# EAGLE schematic PhatStats Slim Enclosure ESP Lolin32 LITE XTP2046 PCB v1.0 (EAGLE 7.6.0)
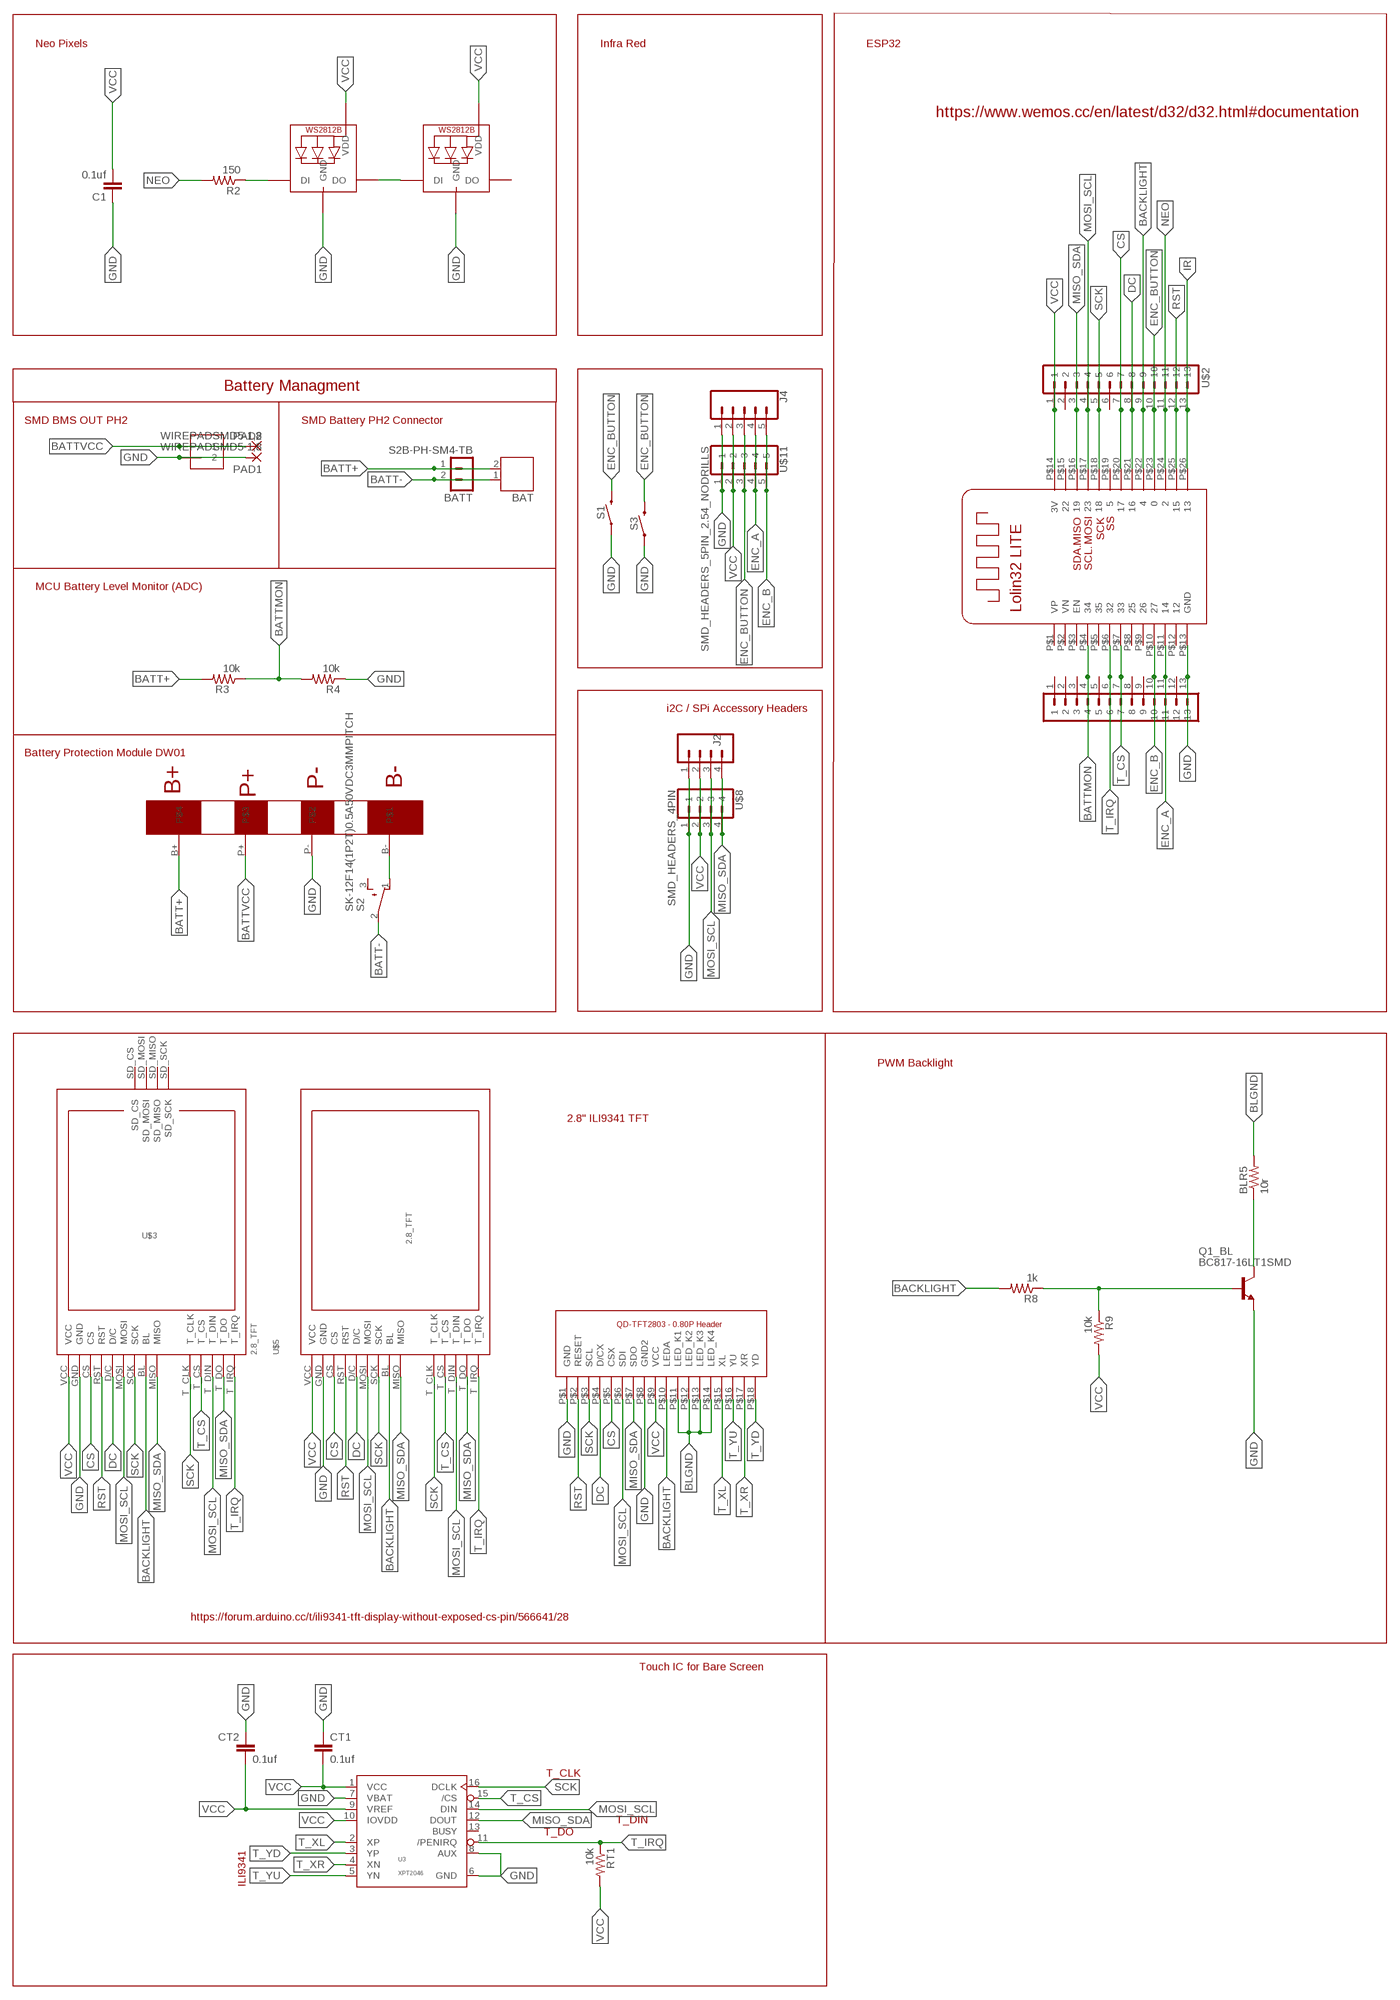
[diagram p0: schematic, sheet 1]

## Parts
0  ILI9341-2.8  [ILI9341-2.8]
BAT  JST-PH2  [JST-PH2]
BATT  S2B-PH-SM4-TB  [S2B-PH-SM4-TB]
BLR5  10r  R-US_M1206  [M1206]
C1  0.1uf  C-EUC1206  [C1206]
CT1  0.1uf  C-EUC1206  [C1206]
CT2  0.1uf  C-EUC1206  [C1206]
DW01-BMS  DW01BATTERYPROT  [DW01BATTERYPROT]
J1  1X2-3.5MM  [1X2-3.5MM]
J2  CONN_04PTH  [1X04]
J4  CONN_05  [1X05]
NEO1  WS2812B5050  [WS2812B]
NEO2  WS2812B5050  [WS2812B]
PAD1  WIREPADSMD5-1,8  [5-1,8]
PAD2  WIREPADSMD5-1,8  [5-1,8]
Q1_BL  BC817-16LT1SMD  [SOT23-BEC]
R2  150  R-US_M1206  [M1206]
R3  10k  R-US_M1206  [M1206]
R4  10k  R-US_M1206  [M1206]
R8  1k  R-US_M1206  [M1206]
R9  10k  R-US_M1206  [M1206]
RT1  10k  R-US_M1206  [M1206]
S1  MOMENTARY-SWITCH-SPST-PTH-6.0MM  [TACTILE_SWITCH_PTH_6.0MM]
S2  SK-12F14(1P2T)0.5A50VDC3MMPITCH  [SK-12F14(1P2T)0.5A50VDC3MMPITCH]
S3  MOMENTARY-SWITCH-SPST-SMD-6.2MM-TALL  [TACTILE_SWITCH_SMD_6.2MM_TALL]
U3  XPT2046  [TSSOP-16]
U$1  SMD_HEADERS_13PIN_2.54_NODRILLS  [SMD_HEADERS_13PIN]
U$2  SMD_HEADERS_13PIN_2.54_NODRILLS  [SMD_HEADERS_13PIN]
U$3  2.8_TFT  [2.8_TFT]
U$5  2.8_TFT  [2.8_TFT]
U$7  TML_LOLIND32_LITE  [TML_LOLIND32_LITE]
U$8  SMD_HEADERS_4PIN  [SMD_HEADERS_4PIN]
U$11  SMD_HEADERS_5PIN_2.54_NODRILLS  [SMD_HEADERS_5PIN]

## Nets
BACKLIGHT: 0.P$10(LEDA) R8.2 U$2.9 U$3.BL U$5.BL U$7.P$22
BATT+: BAT.2 BATT.1 DW01-BMS.B+ R3.2
BATT-: BAT.1 BATT.2 S2.2(P)
BATTMON: R3.1 R4.2 U$1.4 U$7.P$4
BATTVCC: DW01-BMS.P+ J1.1 PAD2.1(P)
BL: BLR5.1 Q1_BL.C
BLGND: 0.P$11(LED_K1) 0.P$12(LED_K2) 0.P$13(LED_K3) 0.P$14(LED_K4) BLR5.2
CS: 0.P$5(CSX) U$2.7 U$3.CS U$5.CS U$7.P$20
DC: 0.P$4(D/CX) U$2.8 U$3.D/C U$5.D/C U$7.P$21
ENC_A: J4.4 U$1.11 U$7.P$11 U$11.4
ENC_B: J4.5 U$1.10 U$7.P$10 U$11.5
ENC_BUTTON: J4.3 S1.3 S3.B2 U$2.10 U$7.P$23 U$11.3
GND: 0.P$1(GND) 0.P$8(GND2) C1.1 CT1.1 CT2.1 DW01-BMS.P- J1.2 J2.1 J4.1 NEO1.3-GND(GND) NEO2.3-GND(GND) PAD1.1(P) Q1_BL.E R4.1 S1.1 S3.A2 U3.6(GND) U3.7(VBAT) U3.8(AUX) U$1.13 U$3.GND U$5.GND U$7.P$13(GND) U$8.1 U$11.1
IR: U$2.13 U$7.P$26
MISO_SDA: 0.P$7(SDO) J2.4 U3.12(DOUT) U$2.3 U$3.MISO U$3.T_DO U$5.MISO U$5.T_DO U$7.P$16 U$8.4
MOSI_SCL: 0.P$6(SDI) J2.3 U3.14(DIN) U$2.4 U$3.MOSI U$3.T_DIN U$5.MOSI U$5.T_DIN U$7.P$17 U$8.3
N$1: DW01-BMS.B- S2.1(O)
N$2: NEO1.2-DOUT(DO) NEO2.4-DIN(DI)
N$4: NEO1.4-DIN(DI) R2.1
N$7: Q1_BL.B R8.1 R9.1
NEO: R2.2 U$2.11 U$7.P$24
RST: 0.P$2(RESET) U$2.12 U$3.RST U$5.RST U$7.P$25
SCK: 0.P$3(SCL) U3.16(DCLK) U$2.5 U$3.SCK U$3.T_CLK U$5.SCK U$5.T_CLK U$7.P$18
T_CS: U3.15(/CS) U$1.7 U$3.T_CS U$5.T_CS U$7.P$7
T_IRQ: RT1.1 U3.11(/PENIRQ) U$1.6 U$3.T_IRQ U$5.T_IRQ U$7.P$6
T_XL: 0.P$15(XL) U3.2(XP)
T_XR: 0.P$17(XR) U3.4(XN)
T_YD: 0.P$18(YD) U3.3(YP)
T_YU: 0.P$16(YU) U3.5(YN)
VCC: 0.P$9(VCC) C1.2 CT1.2 CT2.2 J2.2 J4.2 NEO1.1-VDD(VDD) NEO2.1-VDD(VDD) R9.2 RT1.2 U3.1(VCC) U3.9(VREF) U3.10(IOVDD) U$2.1 U$3.VCC U$5.VCC U$7.P$14(3V) U$8.2 U$11.2
Unconnected: NEO2.2-DOUT(DO) S2.3(S) U3.13(BUSY) U$1.1 U$1.2 U$1.3 U$1.5 U$1.8 U$1.9 U$1.12 U$2.2 U$2.6 U$3.SD_CS U$3.SD_MISO U$3.SD_MOSI U$3.SD_SCK U$7.P$1(VP) U$7.P$2(VN) U$7.P$3(EN) U$7.P$5 U$7.P$8 U$7.P$9 U$7.P$12 U$7.P$15 U$7.P$19

## Notes on the sheet
- Neo Pixels | Infra Red | ESP32
- https://www.wemos.cc/en/latest/d32/d32.html#documentation
- Battery Managment
- SMD BMS OUT PH2 | SMD Battery PH2 Connector
- MCU Battery Level Monitor (ADC)
- i2C / SPi Accessory Headers
- Battery Protection Module DW01
- PWM Backlight
- 2.8" ILI9341 TFT
- https://forum.arduino.cc/t/ili9341-tft-display-without-exposed-cs-pin/566641/28
- Touch IC for Bare Screen
- T_CLK
- T_DIN
- T_DO
- ILI9341

## Library data of the parts
0 = TML_ili9341_0.8Pitch_Header:ILI9341-2.8
BAT = jst-ph:JST-PH2
BATT = con-JST PH:S2B-PH: JST PH series header 2.00mm pitch disconnectable crimp style connectors, horizontal (side entry type), 2 pins
BLR5 R2-R4 R8 R9 RT1 = resistor:R-US_: RESISTOR, American symbol
C1 CT1 CT2 = rcl:C-EU: CAPACITOR, European symbol
DW01-BMS = TML_DW01_BatteryProtectionModule2:DW01BATTERYPROT
J1 = adafruit:1X2: 3.5mm Terminal block http://www.ladyada.net/library/pcb/eaglelibrary.html
J2 = SparkFun-Connectors:CONN_04: Multi connection point. Often used as Generic Header-pin footprint for 0.1 inch spaced/style header connections On any of the 0.1 inch spaced packages, you can populate with these: Break Away Headers - Straight <https://www.sparkfun.com/products/116> (PRT-00116) Break Away Male Headers - Right Angle <https://www.sparkfun.com/products/553> (PRT-00553) Female Headers <https://www.sparkfun.com/products/115> (PRT-00115) Break Away Headers - Machine Pin <https://www.sparkfun.com/products/117> (PRT-00117) Break Away Female Headers - Swiss Machine Pin <https://www.sparkfun.com/products/743> (PRT-00743) For SCREWTERMINALS and SPRING TERMINALS visit here: Screw Terimnals on SparkFun.com <https://www.sparkfun.com/search/results?term=Screw+Terminals> (5mm/3.5mm/2.54mm spacing) This device is also useful as a general connection point to wire up your design to another part of your project. Our various solder wires solder well into these plated through hole pads. Hook-Up Wire - Assortment (Stranded, 22 AWG) <https://www.sparkfun.com/products/11375> (PRT-11375) Hook-Up Wire - Assortment (Solid Core, 22 AWG) <https://www.sparkfun.com/products/11367> (PRT-11367) View the entire wire category on our website here <https://www.sparkfun.com/categories/141> Special notes: Molex polarized connector foot print use with SKU : PRT-08231 with associated crimp pins and housings. 1MM SMD Version SKU: PRT-10208; PROD_ID: CONN-09696
J4 = SparkFun-Connectors:CONN_05: Multi connection point. Often used as Generic Header-pin footprint for 0.1 inch spaced/style header connections On any of the 0.1 inch spaced packages, you can populate with these: Break Away Headers - Straight <https://www.sparkfun.com/products/116> (PRT-00116) Break Away Male Headers - Right Angle <https://www.sparkfun.com/products/553> (PRT-00553) Female Headers <https://www.sparkfun.com/products/115> (PRT-00115) Break Away Headers - Machine Pin <https://www.sparkfun.com/products/117> (PRT-00117) Break Away Female Headers - Swiss Machine Pin <https://www.sparkfun.com/products/743> (PRT-00743) For SCREWTERMINALS and SPRING TERMINALS visit here: Screw Terimnals on SparkFun.com <https://www.sparkfun.com/search/results?term=Screw+Terminals> (5mm/3.5mm/2.54mm spacing) This device is also useful as a general connection point to wire up your design to another part of your project. Our various solder wires solder well into these plated through hole pads. Hook-Up Wire - Assortment (Stranded, 22 AWG) <https://www.sparkfun.com/products/11375> (PRT-11375) Hook-Up Wire - Assortment (Solid Core, 22 AWG) <https://www.sparkfun.com/products/11367> (PRT-11367) View the entire wire category on our website here <https://www.sparkfun.com/categories/141> Special notes: Molex polarized connector foot print use with SKU : PRT-08231 with associated crimp pins and housings. 1MM SMD Version SKU: PRT-10208
NEO1 NEO2 = adafruit:WS2812B
PAD1 PAD2 = wirepad:WIREPAD: Wire PAD connect wire on PCB
Q1_BL = transistor-npn:BC817*: NPN Transistor
S1 = SparkFun-Switches:MOMENTARY-SWITCH-SPST: Momentary Switch (Pushbutton) - SPST Normally-open (NO) SPST momentary switches (buttons, pushbuttons). Variants PTH-12MM - 12mm square, through-hole Momentary Pushbutton Switch - 12mm Square <https://www.sparkfun.com/products/9190> (COM-09190) PTH-6.0MM, PTH-6.0MM-KIT - 6.0mm square, through-hole Mini Pushbutton Switch <https://www.sparkfun.com/products/97> (COM-00097) KIT package intended for soldering kit's - only one side of pads' copper is exposed. PTH-RIGHT-ANGLE-KIT - Right-angle, through-hole Right Angle Tactile Button <https://www.sparkfun.com/products/10791> - Used on SparkFun BigTime Watch Kit <https://www.sparkfun.com/products/11734> SMD-12MM - 12mm square, surface-mount Tactile Button - SMD (12mm) <https://www.sparkfun.com/products/12993> (COM-12993) Used on SparkFun PicoBoard <https://www.sparkfun.com/products/11888> SMD-4.5MM - 4.5mm Square Trackball Switch Used on SparkFun Blackberry Trackballer Breakout <https://www.sparkfun.com/products/13169> SMD-4.6MMX2.8MM - 4.60mm x 2.80mm, surface mount Used on SparkFun SAMD21 Mini Breakout <https://www.sparkfun.com/products/13664> SMD-5.2MM, SMD-5.2-REDUNDANT - 5.2mm square, surface-mount Mini Pushbutton Switch - SMD <https://www.sparkfun.com/products/8720> (COM-08720) Used on Arduino Pro Mini <https://www.sparkfun.com/products/11114> REDUNDANT package connects both switch circuits together SMD-6.0X3.5MM - 6.0 x 3.5mm, surface mount Momentary Reset Switch SMD <https://www.sparkfun.com/products/8229> (COM-08229) SMD-6.2MM-TALL - 6.2mm square, surface mount Tactile Button - SMD (6mm) <https://www.sparkfun.com/products/12992> Used on SparkFun Digital Sandbox <https://www.sparkfun.com/products/12651> SMD-RIGHT-ANGLE - Right-angle, surface mount Used on SparkFun Block for Intel® Edison - Arduino <https://www.sparkfun.com/products/13036>; PROD_ID: SWCH-08441; SF_SKU: COM-00097
S2 = TML_SK-12F14(1P2T)  90D 0.5a 50vdc 3mm pitch:SK-12F14(1P2T)0.5A50VDC3MMPITCH: SK-12F14(1P2T) 0.5a 50vdc 3mm pitch
S3 = SparkFun-Switches:MOMENTARY-SWITCH-SPST: Momentary Switch (Pushbutton) - SPST Normally-open (NO) SPST momentary switches (buttons, pushbuttons). Variants PTH-12MM - 12mm square, through-hole Momentary Pushbutton Switch - 12mm Square <https://www.sparkfun.com/products/9190> (COM-09190) PTH-6.0MM, PTH-6.0MM-KIT - 6.0mm square, through-hole Mini Pushbutton Switch <https://www.sparkfun.com/products/97> (COM-00097) KIT package intended for soldering kit's - only one side of pads' copper is exposed. PTH-RIGHT-ANGLE-KIT - Right-angle, through-hole Right Angle Tactile Button <https://www.sparkfun.com/products/10791> - Used on SparkFun BigTime Watch Kit <https://www.sparkfun.com/products/11734> SMD-12MM - 12mm square, surface-mount Tactile Button - SMD (12mm) <https://www.sparkfun.com/products/12993> (COM-12993) Used on SparkFun PicoBoard <https://www.sparkfun.com/products/11888> SMD-4.5MM - 4.5mm Square Trackball Switch Used on SparkFun Blackberry Trackballer Breakout <https://www.sparkfun.com/products/13169> SMD-4.6MMX2.8MM - 4.60mm x 2.80mm, surface mount Used on SparkFun SAMD21 Mini Breakout <https://www.sparkfun.com/products/13664> SMD-5.2MM, SMD-5.2-REDUNDANT - 5.2mm square, surface-mount Mini Pushbutton Switch - SMD <https://www.sparkfun.com/products/8720> (COM-08720) Used on Arduino Pro Mini <https://www.sparkfun.com/products/11114> REDUNDANT package connects both switch circuits together SMD-6.0X3.5MM - 6.0 x 3.5mm, surface mount Momentary Reset Switch SMD <https://www.sparkfun.com/products/8229> (COM-08229) SMD-6.2MM-TALL - 6.2mm square, surface mount Tactile Button - SMD (6mm) <https://www.sparkfun.com/products/12992> Used on SparkFun Digital Sandbox <https://www.sparkfun.com/products/12651> SMD-RIGHT-ANGLE - Right-angle, surface mount Used on SparkFun Block for Intel® Edison - Arduino <https://www.sparkfun.com/products/13036>; PROD_ID: SWCH-11966; SF_SKU: COM-12992
U3 = TML_XPT2046:XPT2046: XPT2046 touch screen controller General Description The XPT2046 is a 4-wire resistive touch screen controller that incorporates a 12-bit 125 kHz sampling SAR type A/D converter. The XPT2046 operates down to 2.2V supply voltage and supports digital I/O interface voltage from 1.5V to VCC in order to connect low voltage uP. The XPT2046 can detect the pressed screen location by performing two A/D conversions. In addition to location, the XPT2046 also measures touch screen pressure.On-chip VREF can be utilized for analog auxiliary input, temperature measurement and battery monitoring withthe ability to measure voltage from 0V to 5V. The XPT2046 also has an on-chip temperature sensor The XPT2046 is available in 16pin QFN thin package(0.75mm in height) and has the operating temperature range of -40°C to +85°C Features 12 bit SAR type A/D converter with S/H circuit Low voltage operation (VCC = 2.2V ∼ 3.6V) Low voltage digital I/F (1.5V ∼ VCC) 4-wire I/F Sampling frequency: 125 kHz (max) On-Chip voltage reference (2.5V) Pen pressure measurement On-chip thermo sensor Direct battery masurement Low power consumption (260μA) Package 16pin QFN Check prices <https://pricing.snapeda.com/parts/XPT2046/Xptek/view-part?ref=eda>; AVAILABILITY: Not in stock; DESCRIPTION: RASPBERRY PI 3.5 TFT DISPLAY; MF: Xptek; MP: XPT2046; PACKAGE: Package; PRICE: None
U$1 U$2 = TML_SMD_Headers_2.54_NoDrill:SMD_HEADERS_13PIN_2.54_NODRILLS
U$3 = TML_ili9341-2.8_tft-display_Corrected:2.8_TFT: ILI9341 2.8" 2.8 inch TFT SPI Touch Panel 240X320 http://www.lcdwiki.com/2.8inch_SPI_Module_ILI9341_SKU:MSP2807 http://www.lcdwiki.com/Run_Arduino_Demo_in_spi_model
U$5 = TML_ili9341-2.8_tft-display_PinHeader only:2.8_TFT: ILI9341 2.8" 2.8 inch TFT SPI Touch Panel 240X320 http://www.lcdwiki.com/2.8inch_SPI_Module_ILI9341_SKU:MSP2807 http://www.lcdwiki.com/Run_Arduino_Demo_in_spi_model
U$7 = TML_Wemos LOLIN32 LITE ESP32 Round Pads:TML_LOLIND32_LITE: Wemos Lolin32 LITE Lolin32 LITE is a development board based on ESP32. On this schematic, this board is designed with battery port. Pins VP and VN are Not Connected pins.
U$8 = TML_SMD_Headers_2.54_NoDrill:SMD_HEADERS_4PIN
U$11 = TML_SMD_Headers_2.54_NoDrill:SMD_HEADERS_5PIN_2.54_NODRILLS